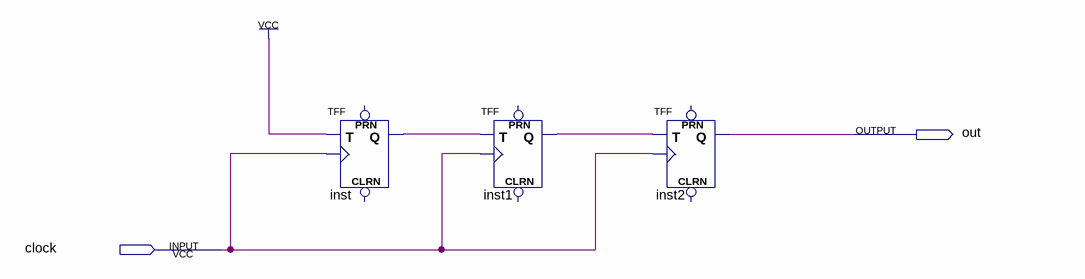
[diagram p0: schematic sheet]
// Quartus schematic DivisorFrequencia.bdf as structural Verilog: 3 symbols, 2 pins
module DivisorFrequencia (
  input  clock,
  output out
);

  wire inst1_q, inst_q;

  TFF inst (.T(1'b1), .CLK(clock), .Q(inst_q));  // open: PRN, CLRN
  TFF inst1 (.T(inst_q), .CLK(clock), .Q(inst1_q));  // open: PRN, CLRN
  TFF inst2 (.T(inst1_q), .CLK(clock), .Q(out));  // open: PRN, CLRN
endmodule
